# Altium schematic sheet iMX6 Rex_V1I1 Project.SchDoc
size A3; CompanyName: FEDEVEL; Organization: FEDEVEL; DocumentNumber: 20; Revision: V1I1; SheetNumber: 20; SheetTotal: 20; PageSetup: Record=PageOptions|CenterHorizontal=True|CenterVertical=True|PrintScale=1.07|XCorrection=1.00|YCorrection=1.00|PrintKind=1|BorderSize=5000000|LeftOffset=0|BottomOffset=0|Orientation=2|PaperLength=1000|PaperWidth=1000|Scale=100|PaperSource=7|PrintQuality=600|MediaType=1|DitherType=10|PaperKind=A3|PrintScaleMode=1; ProjectName: KDS C6A816x Module
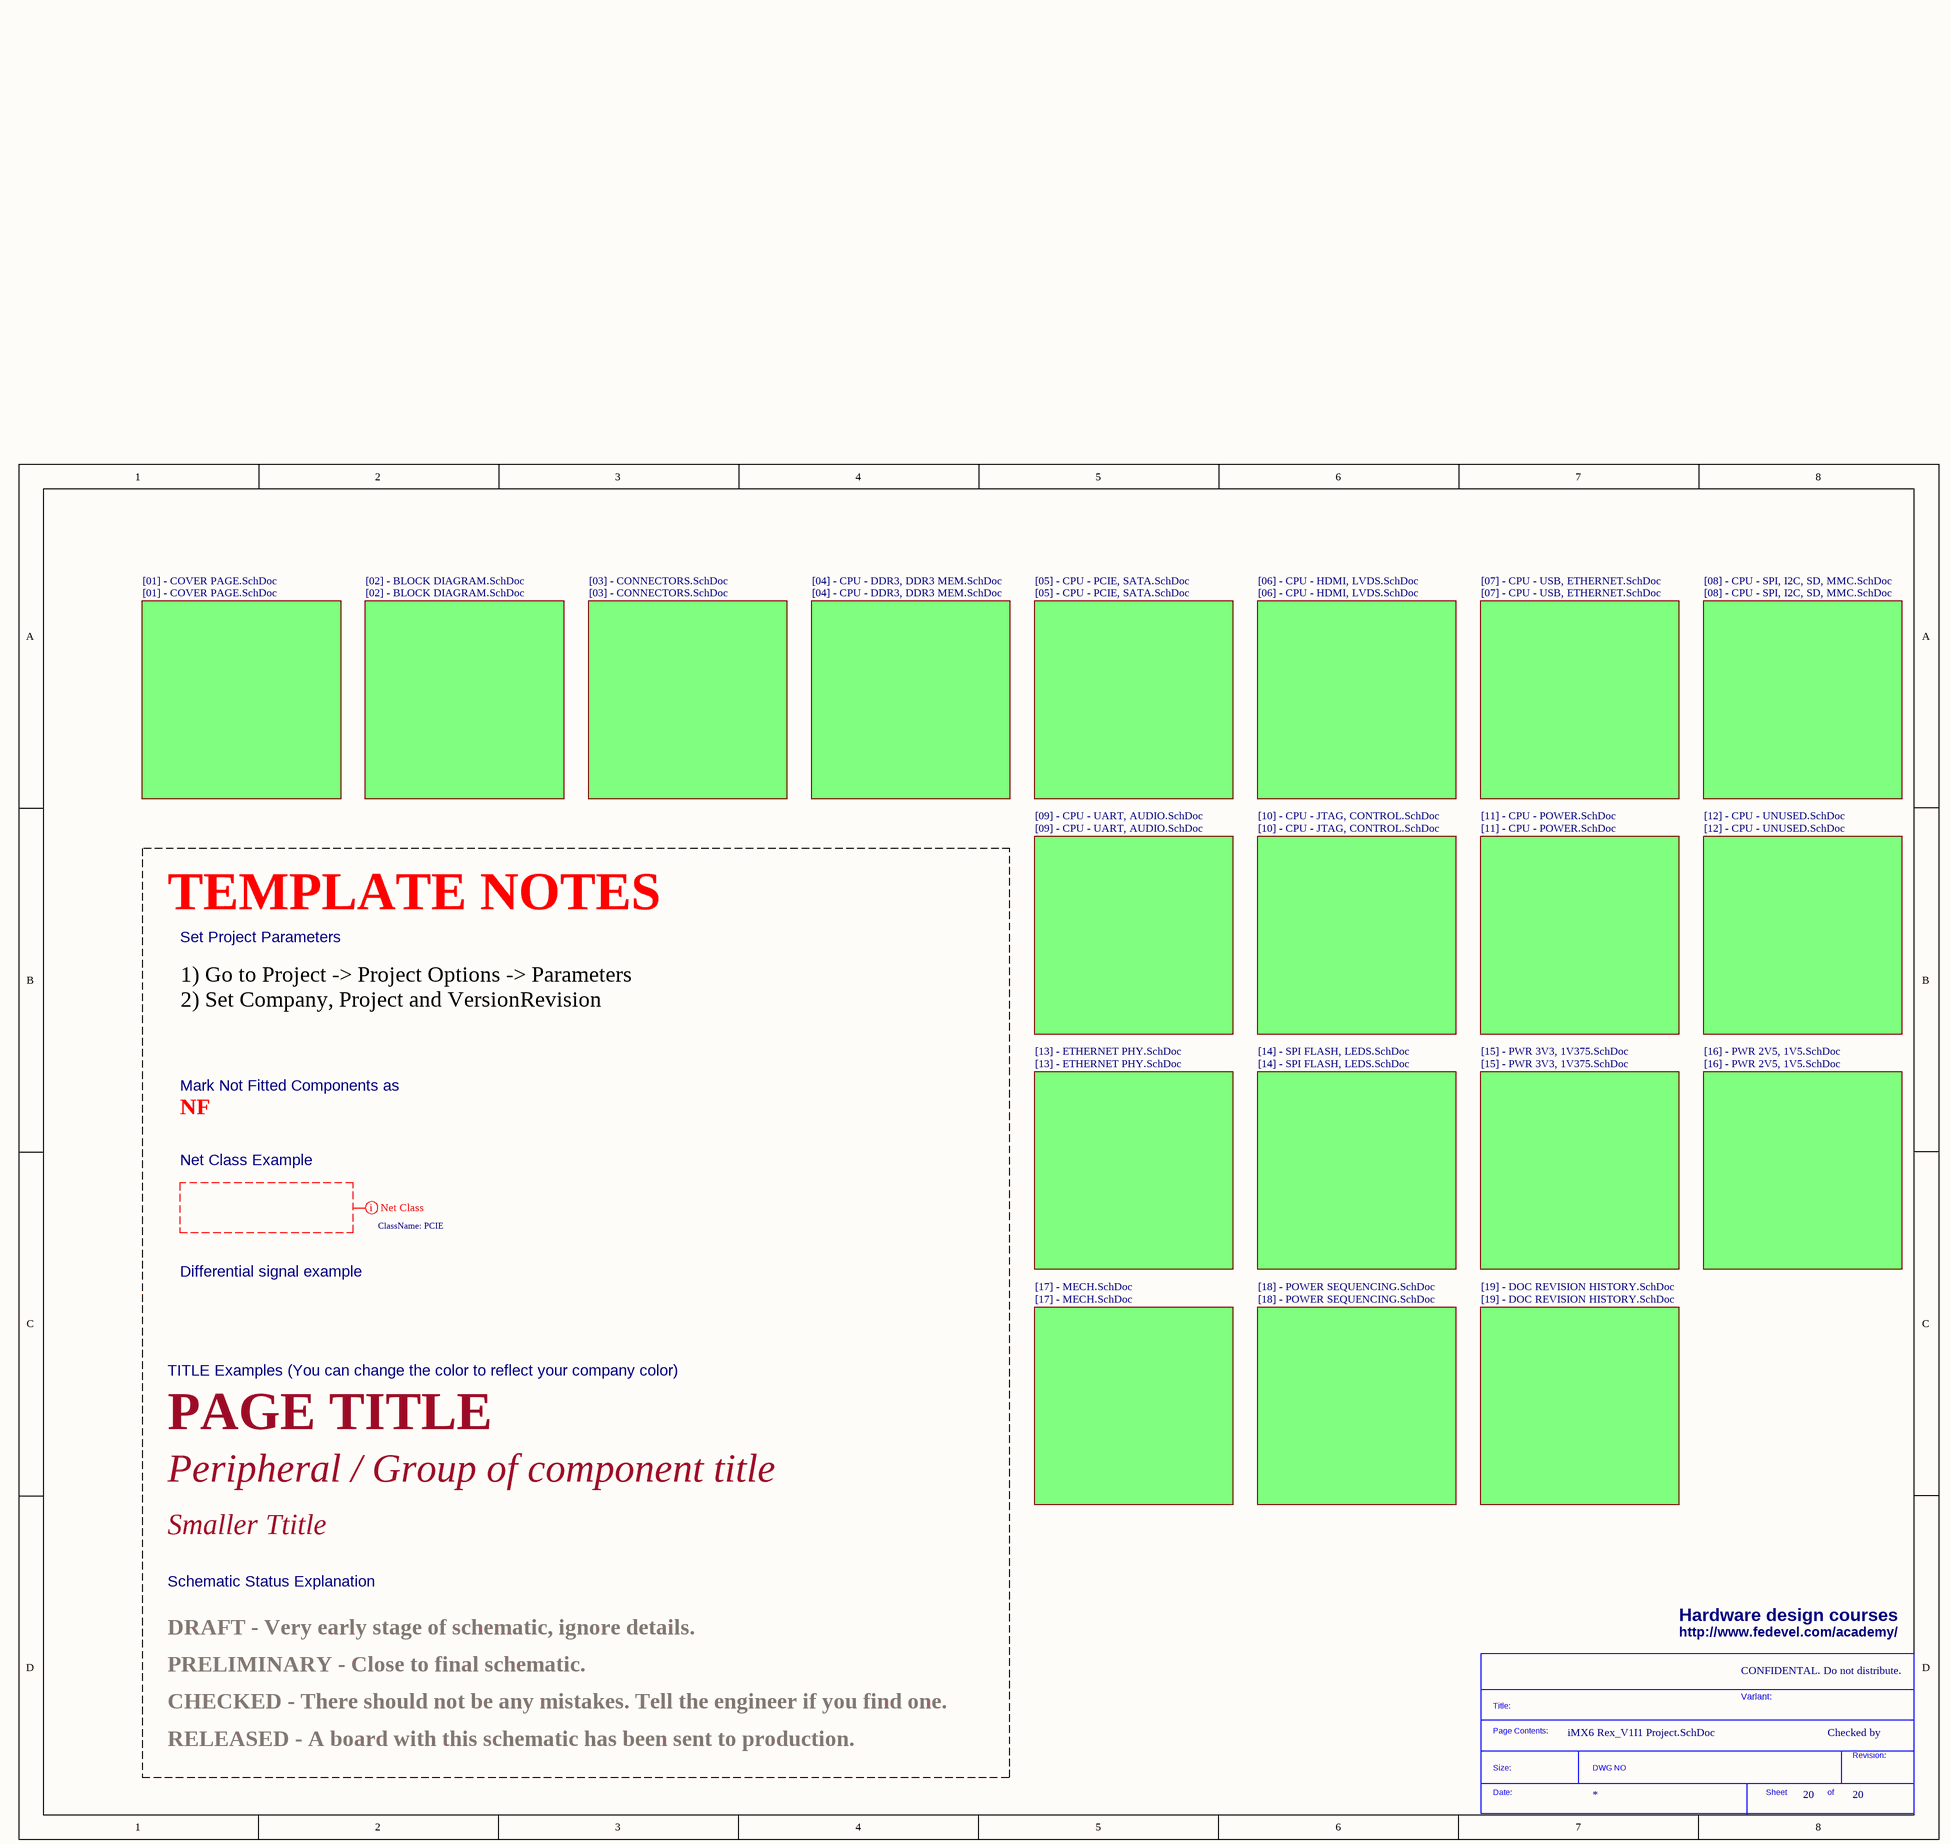
[diagram p0: iMX6 Rex_V1I1 Project.SchDoc]

## Parts
*  SDTitleBlock  (value not drawn)  (graphical)

## Sub-sheets
[01] - COVER PAGE.SchDoc = [01] - COVER PAGE.SchDoc: no entries
[02] - BLOCK DIAGRAM.SchDoc = [02] - BLOCK DIAGRAM.SchDoc: no entries
[03] - CONNECTORS.SchDoc = [03] - CONNECTORS.SchDoc: no entries
[04] - CPU - DDR3, DDR3 MEM.SchDoc = [04] - CPU - DDR3, DDR3 MEM.SchDoc: no entries
[05] - CPU - PCIE, SATA.SchDoc = [05] - CPU - PCIE, SATA.SchDoc: no entries
[06] - CPU - HDMI, LVDS.SchDoc = [06] - CPU - HDMI, LVDS.SchDoc: no entries
[07] - CPU - USB, ETHERNET.SchDoc = [07] - CPU - USB, ETHERNET.SchDoc: no entries
[08] - CPU - SPI, I2C, SD, MMC.SchDoc = [08] - CPU - SPI, I2C, SD, MMC.SchDoc: no entries
[09] - CPU - UART, AUDIO.SchDoc = [09] - CPU - UART, AUDIO.SchDoc: no entries
[10] - CPU - JTAG, CONTROL.SchDoc = [10] - CPU - JTAG, CONTROL.SchDoc: no entries
[11] - CPU - POWER.SchDoc = [11] - CPU - POWER.SchDoc: no entries
[12] - CPU - UNUSED.SchDoc = [12] - CPU - UNUSED.SchDoc: no entries
[13] - ETHERNET PHY.SchDoc = [13] - ETHERNET PHY.SchDoc: no entries
[14] - SPI FLASH, LEDS.SchDoc = [14] - SPI FLASH, LEDS.SchDoc: no entries
[15] - PWR 3V3, 1V375.SchDoc = [15] - PWR 3V3, 1V375.SchDoc: no entries
[16] - PWR 2V5, 1V5.SchDoc = [16] - PWR 2V5, 1V5.SchDoc: no entries
[17] - MECH.SchDoc = [17] - MECH.SchDoc: no entries
[18] - POWER SEQUENCING.SchDoc = [18] - POWER SEQUENCING.SchDoc: no entries
[19] - DOC REVISION HISTORY.SchDoc = [19] - DOC REVISION HISTORY.SchDoc: no entries

## Layout directives
net class PCIE: (no net found under the mark)

## Notes on the sheet
- TEMPLATE NOTES
- Set Project Parameters
- 1) Go to Project -> Project Options -> Parameters
  2) Set Company, Project and VersionRevision
- NF
- Mark Not Fitted Components as
- Net Class Example
- Differential signal example
- TITLE Examples (You can change the color to reflect your company color)
- PAGE TITLE
- Peripheral / Group of component title
- Smaller Ttitle
- Schematic Status Explanation
- Hardware design courses
- PRELIMINARY - Close to final schematic.
- DRAFT - Very early stage of schematic, ignore details.
- http://www.fedevel.com/academy/
- CONFIDENTAL. Do not distribute.
- CHECKED - There should not be any mistakes. Tell the engineer if you find one.
- Variant:
- Checked by
- RELEASED - A board with this schematic has been sent to production.
- (in symbol SDTitleBlock) Title:; Page Contents:; Revision:; Size:; DWG NO; Date:; Sheet; of